# Altium schematic sheet 07_Power_Supply.SchDoc
size A4; SheetNumber: 8; SheetTotal: 9
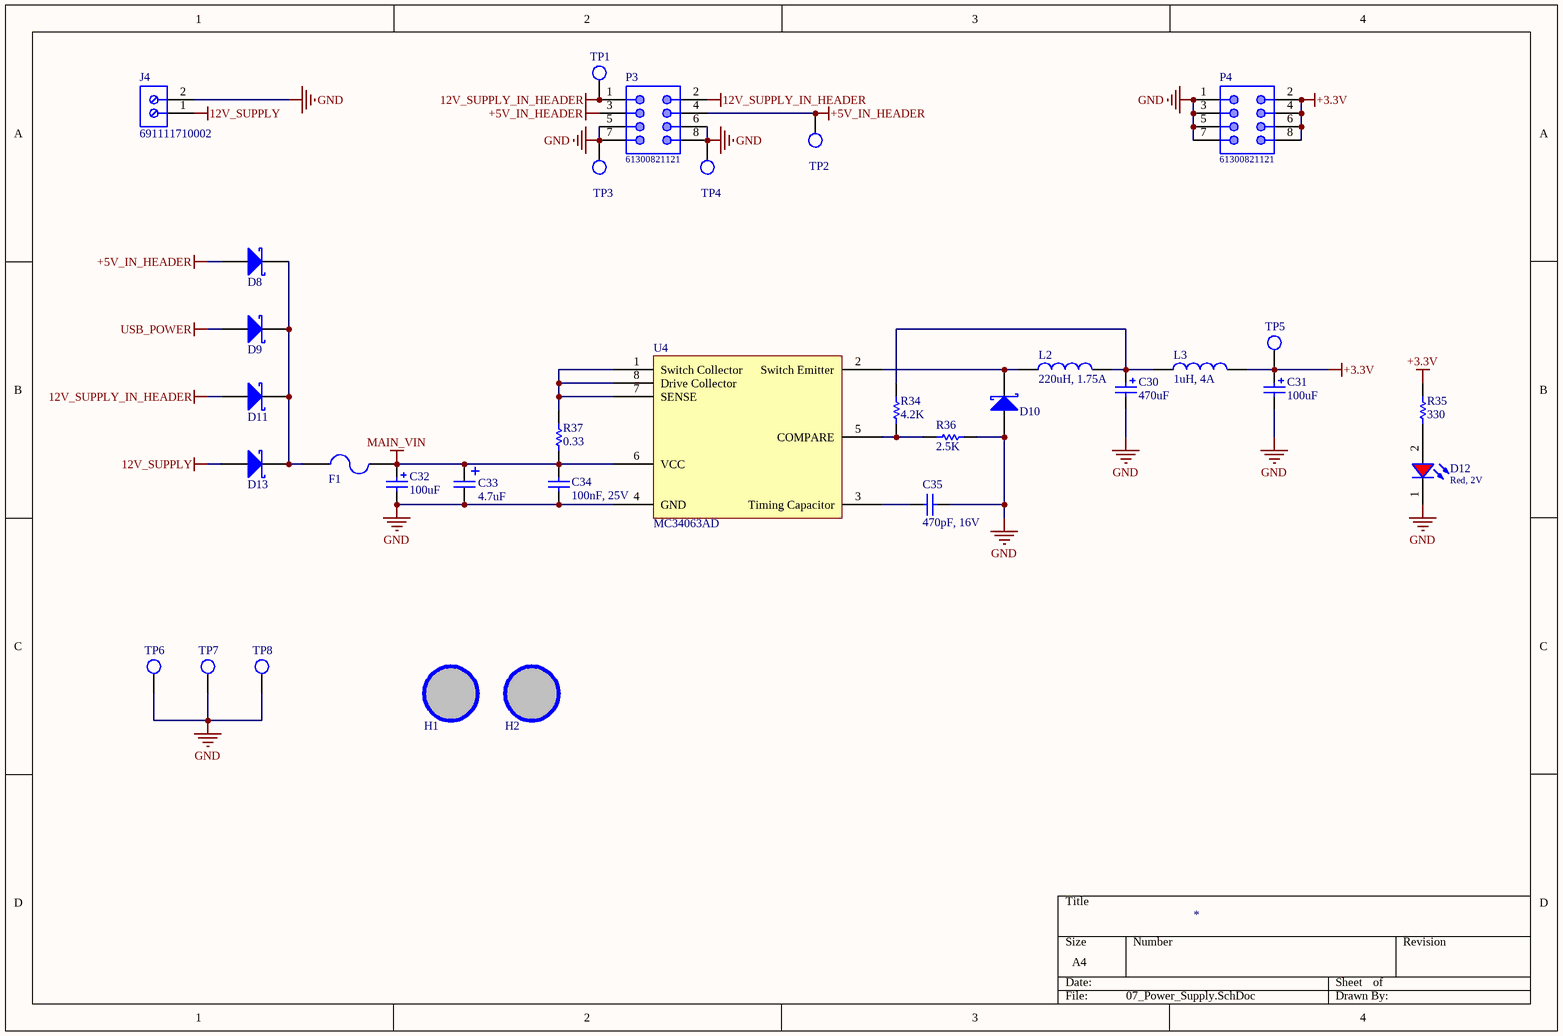
[diagram p0: 07_Power_Supply.SchDoc]

## Parts
C30  value 470uF  [CAP ALU SIZE F]  (hidden comment: Cap Pol SMD)
C31  value 100uF  [CAP ALU SIZE D]  (hidden comment: Cap Pol SMD)
C32  value 100uF  [CAP ALU SIZE D]  (hidden comment: Cap Pol SMD)
C33  value 4.7uF  [CAPMP3216X18N]  (hidden comment: Tantalum Capacitor)
C34  100nF, 25V  [WCAP-CSGP_0603_H=0.8mm_Reflow]
C35  470pF, 16V  [WCAP-CSGP_0603_H=0.8mm_Reflow]
D8  D Schottky  [SS34]  (value not drawn)
D9  D Schottky  [SS34]  (value not drawn)
D10  D Schottky  [SS34]  (value not drawn)
D11  D Schottky  [SS34]  (value not drawn)
D12  Red, 2V  [WL-SMCW_0603_H=0.7mm]
D13  D Schottky  [SS34]  (value not drawn)
F1  Fuse  [FUSE SMD]  (value not drawn)
H1  Hole  [LO KHOAN 3MM]  (value not drawn)
H2  Hole  [LO KHOAN 3MM]  (value not drawn)
J4  691111710002  [691111710002]
L2  220uH, 1.75A  [WE-PD2A_5848]
L3  1uH, 4A  [WE-PD2A_4532]
P3  61300821121  [61300821121]
P4  61300821121  [61300821121]
R34  value 4.2K  [RES-SM-0603]  (hidden comment: RESISTOR SMD)
R35  value 330  [RES-SM-0603]  (hidden comment: RESISTOR SMD)
R36  value 2.5K  [RES-SM-0603]  (hidden comment: RESISTOR SMD)
R37  value 0.33  [RES-SM-0805]  (hidden comment: RESISTOR SMD)
TP1  Test point  [TP]  (value not drawn)
TP2  Test point  [TP]  (value not drawn)
TP3  Test point  [TP]  (value not drawn)
TP4  Test point  [TP]  (value not drawn)
TP5  Test point  [TP]  (value not drawn)
TP6  Test point  [TP]  (value not drawn)
TP7  Test point  [TP]  (value not drawn)
TP8  Test point  [TP]  (value not drawn)
U4  MC34063AD  [SOIC127P600X170-8N]

## Nets
12V_SUPPLY: D13.1(A) J4.1
12V_SUPPLY_IN_HEADER: D11.1(A) P3.1 P3.2 TP1.1
+3.3V: C31.1 L3.2 P4.2 P4.4 P4.6 P4.8 R35.2 TP5.1
+5V_IN_HEADER: D8.1(A) P3.3 P3.4 TP2.1
GND: C30.2 C31.2 C32.2 C33.2 C34.1 C35.2 D10.1(A) D12.1(K) J4.2 P3.5 P3.6 P3.7 P3.8 P4.1 P4.3 P4.5 P4.7 R36.1 TP3.1 TP4.1 TP6.1 TP7.1 TP8.1 U4.4(GND)
MAIN_VIN: C32.1 C33.1 C34.2 F1.2 R37.1 U4.6(VCC)
USB_POWER: D9.1(A)
NetC30_1: C30.1 L2.2 L3.1 R34.2
NetC35_1: C35.1 U4.3(Timing_Capacitor)
NetD8_2: D8.2(K) D9.2(K) D11.2(K) D13.2(K) F1.1
NetD10_2: D10.2(K) L2.1 U4.2(Switch_Emitter)
NetD12_2: D12.2(A) R35.1
NetR34_1: R34.1 R36.2 U4.5(COMPARE)
NetR37_2: R37.2 U4.1(Switch_Collector) U4.7(SENSE) U4.8(Drive_Collector)

Not connected (* = marked no-connect by the designer): H1 1; H2 1

## Library data of the parts
C30-C32 = Cap Pol SMD: Polarized Capacitor (Radial)
C34 = 885012206071: WCAP-CSGP Multilayer Ceramic Chip Capacitor, General Purpose, size 0603, X7R, 100nF, 25V; Manufacturer: Wurth Elektronik; Rated Voltage: 25VDC; Isolation Resistance: >=5GOhm; Capacitance Tolerance: +/-10%; Technical Reference: X7R0603104K025DFCT10000; ComponentLink1Description: Manufacturer; ComponentLink1URL: http://www.we-online.de; ComponentLink2Description: Datasheet; ComponentLink2URL: https://www.we-online.com/catalog/datasheet/885012206071.pdf; Operating Temperature: -55 to +125degC; Packaging: Tape and Reel; Manufacturer Part Number: 885012206071; Published Date: May 2020; Ceramic Type: X7R; Dissipation Factor: =<3.5%; Height: 0.8mm; Mounting Technology: SMT; Size: 0603; Capacitance: 100nF
C35 = 885012006027: WCAP-CSGP Multilayer Ceramic Chip Capacitor, General Purpose, size 0603, NP0, 470pF, 16V; Manufacturer: Wurth Elektronik; Rated Voltage: 16VDC; Isolation Resistance: >=10GOhm; Capacitance Tolerance: +/-5%; Dissipation Factor: Q>=1000; Technical Reference: NP00603471J016DFCT10000; ComponentLink1Description: Manufacturer; ComponentLink1URL: http://www.we-online.de; ComponentLink2Description: Datasheet; ComponentLink2URL: https://www.we-online.com/catalog/datasheet/885012006027.pdf; Operating Temperature: -55 to +125degC; Packaging: Tape and Reel; Manufacturer Part Number: 885012006027; Published Date: May 2020; Ceramic Type: NP0; Height: 0.8mm; Mounting Technology: SMT; Size: 0603; Capacitance: 470pF
D8-D11 D13 = D Schottky: Schottky Diode; Published: 8-Jun-2000; LatestRevisionDate: 17-Jul-2002; LatestRevisionNote: Re-released for DXP Platform.; PackageReference: SMB; Publisher: Altium Limited; PackageDescription: DO-214-AA/SMB; 2 C-Bend Leads; Body 5.3 x 3.6 mm, inc. leads (LxW); Code_JEDEC: DO-214-AA
D12 = 150060RS75000: WL-SMCW SMT Mono-color Chip LED Waterclear, size 0603, Red, 2V, 140deg; Chip Technology: AlInGaP; Dominant Wavelength typ.: 625nm; Luminous Intensity typ.: 250mcd; Peak Wavelength typ.: 630nm; Viewing Angle: 140deg; ComponentLink1Description: Manufacturer; ComponentLink1URL: http://www.we-online.de; ComponentLink2URL: https://www.we-online.com/catalog/datasheet/150060RS75000.pdf; ComponentLink2Description: Datasheet; Forward Voltage typ.: 2V; Emitting Color: Red; Mounting Technology: SMT; Operating Temperature: -40 to +85degC; Published Date: December 2019; Part Number: 150060RS75000; Packaging: Tape and Reel; Size: 0603; Publisher: Wurth Elektronik
H1 H2 = Hole: Hole 3mm
J4 = 691111710002: WR-TBL Serie 111 Horizontal Entry Modular, Pressure Clamp, pitch 5mm, 2p; Compliance: Lead free / RoHS; Modularity: Yes; PCB/Cable/Panel: PCB; Pin Number: 2; Rated Current [UL]: 15A; Working Voltage [UL]: 250VAC; ComponentLink1Description: Manufacturer; ComponentLink1URL: http://www.we-online.de; ComponentLink2URL: https://katalog.we-online.de/em/datasheet/691111710002.pdf; ComponentLink2Description: Datasheet; Mounting Technology: THT; Part Number: 691111710002; Packaging: Box; Operating Temperature: -40 to +105degC; Pitch: 5mm; Published Date: October 2019; Type: Horizontal; Publisher: Wurth Elektronik; Application: Pressure Clamp
L2 = 784774222: WE-PD2A SMT Power Inductor, size 5848, 220uH, 0.41A; Manufacturer: Wurth Elektronik; DC Resistance max.: 1.57Ohm; Saturation Current: 0.47A; Self Resonant Frequency: 5MHz; DC Resistance typ.: 0.945Ohm; Rated Voltage: 80VDC; ComponentLink1Description: Manufacturer; ComponentLink1URL: http://www.we-online.de; ComponentLink2Description: Datasheet; ComponentLink2URL: https://www.we-online.com/catalog/datasheet/784774222.pdf; Manufacturer Part Number: 784774222; Published Date: May 2020; Rated Current: 0.41A; Inductance: 220uH; Operating Temperature: -40 to +125degC; Mounting Technology: SMT; Packaging: Tape and Reel; Size: 5848
L3 = 7847730: WE-PD2A SMT Power Inductor, size 4532, 1uH, 4A; Manufacturer: Wurth Elektronik; DC Resistance max.: 0.049Ohm; Saturation Current: 5.72A; Self Resonant Frequency: 110MHz; DC Resistance typ.: 0.014Ohm; Rated Voltage: 80VDC; ComponentLink1Description: Manufacturer; ComponentLink1URL: http://www.we-online.de; ComponentLink2Description: Datasheet; ComponentLink2URL: https://www.we-online.com/catalog/datasheet/7847730.pdf; Manufacturer Part Number: 7847730; Published Date: May 2020; Rated Current: 4A; Inductance: 1uH; Operating Temperature: -40 to +125degC; Mounting Technology: SMT; Packaging: Tape and Reel; Size: 4532
P3 P4 = 61300821121: WR-PHD Pin Header, THT, pitch 2.54mm, Dual Row, Vertical, 8p; Manufacturer: Wurth Elektronik; Pin Number: 8; Rated Current: 3A; Working Voltage: 250VAC; Withstanding Voltage: 500VAC; Contact Resistance: 20mOhm; ComponentLink1Description: Manufacturer; ComponentLink1URL: http://www.we-online.de; ComponentLink2Description: Datasheet; ComponentLink2URL: https://www.we-online.com/catalog/datasheet/61300821121.pdf; Manufacturer Part Number: 61300821121; Published Date: May 2020; Pitch: 2.54mm; Operating Temperature: -40 to +105degC; Mounting Technology: THT; Packaging: Bag; Gender: Pin Header; Row Number: Dual; Orientation: Vertical
R34-R37 = RESISTOR SMD: Resistor
TP1-TP8 = TP: ComponentLink1Description: Supplier 1 Link
U4 = MC34063: 1.5-A boost, buck, inverting switching regulator, operation from 0°C to 70°C; Manufacturer: Texas Instruments; ComponentLink1Description: Local Supplier Link; ComponentLink1URL: https://www.thegioiic.com/products/mc34063ad-ic-dieu-chinh-tang-giam-ap-1-5a-8-soic; Local Supplier: Thegioiic; Local Supplier P/N: MC34063AD; Manufacturer P/N: MC34063AD